# Altium project XS128转接板.PRJPCB
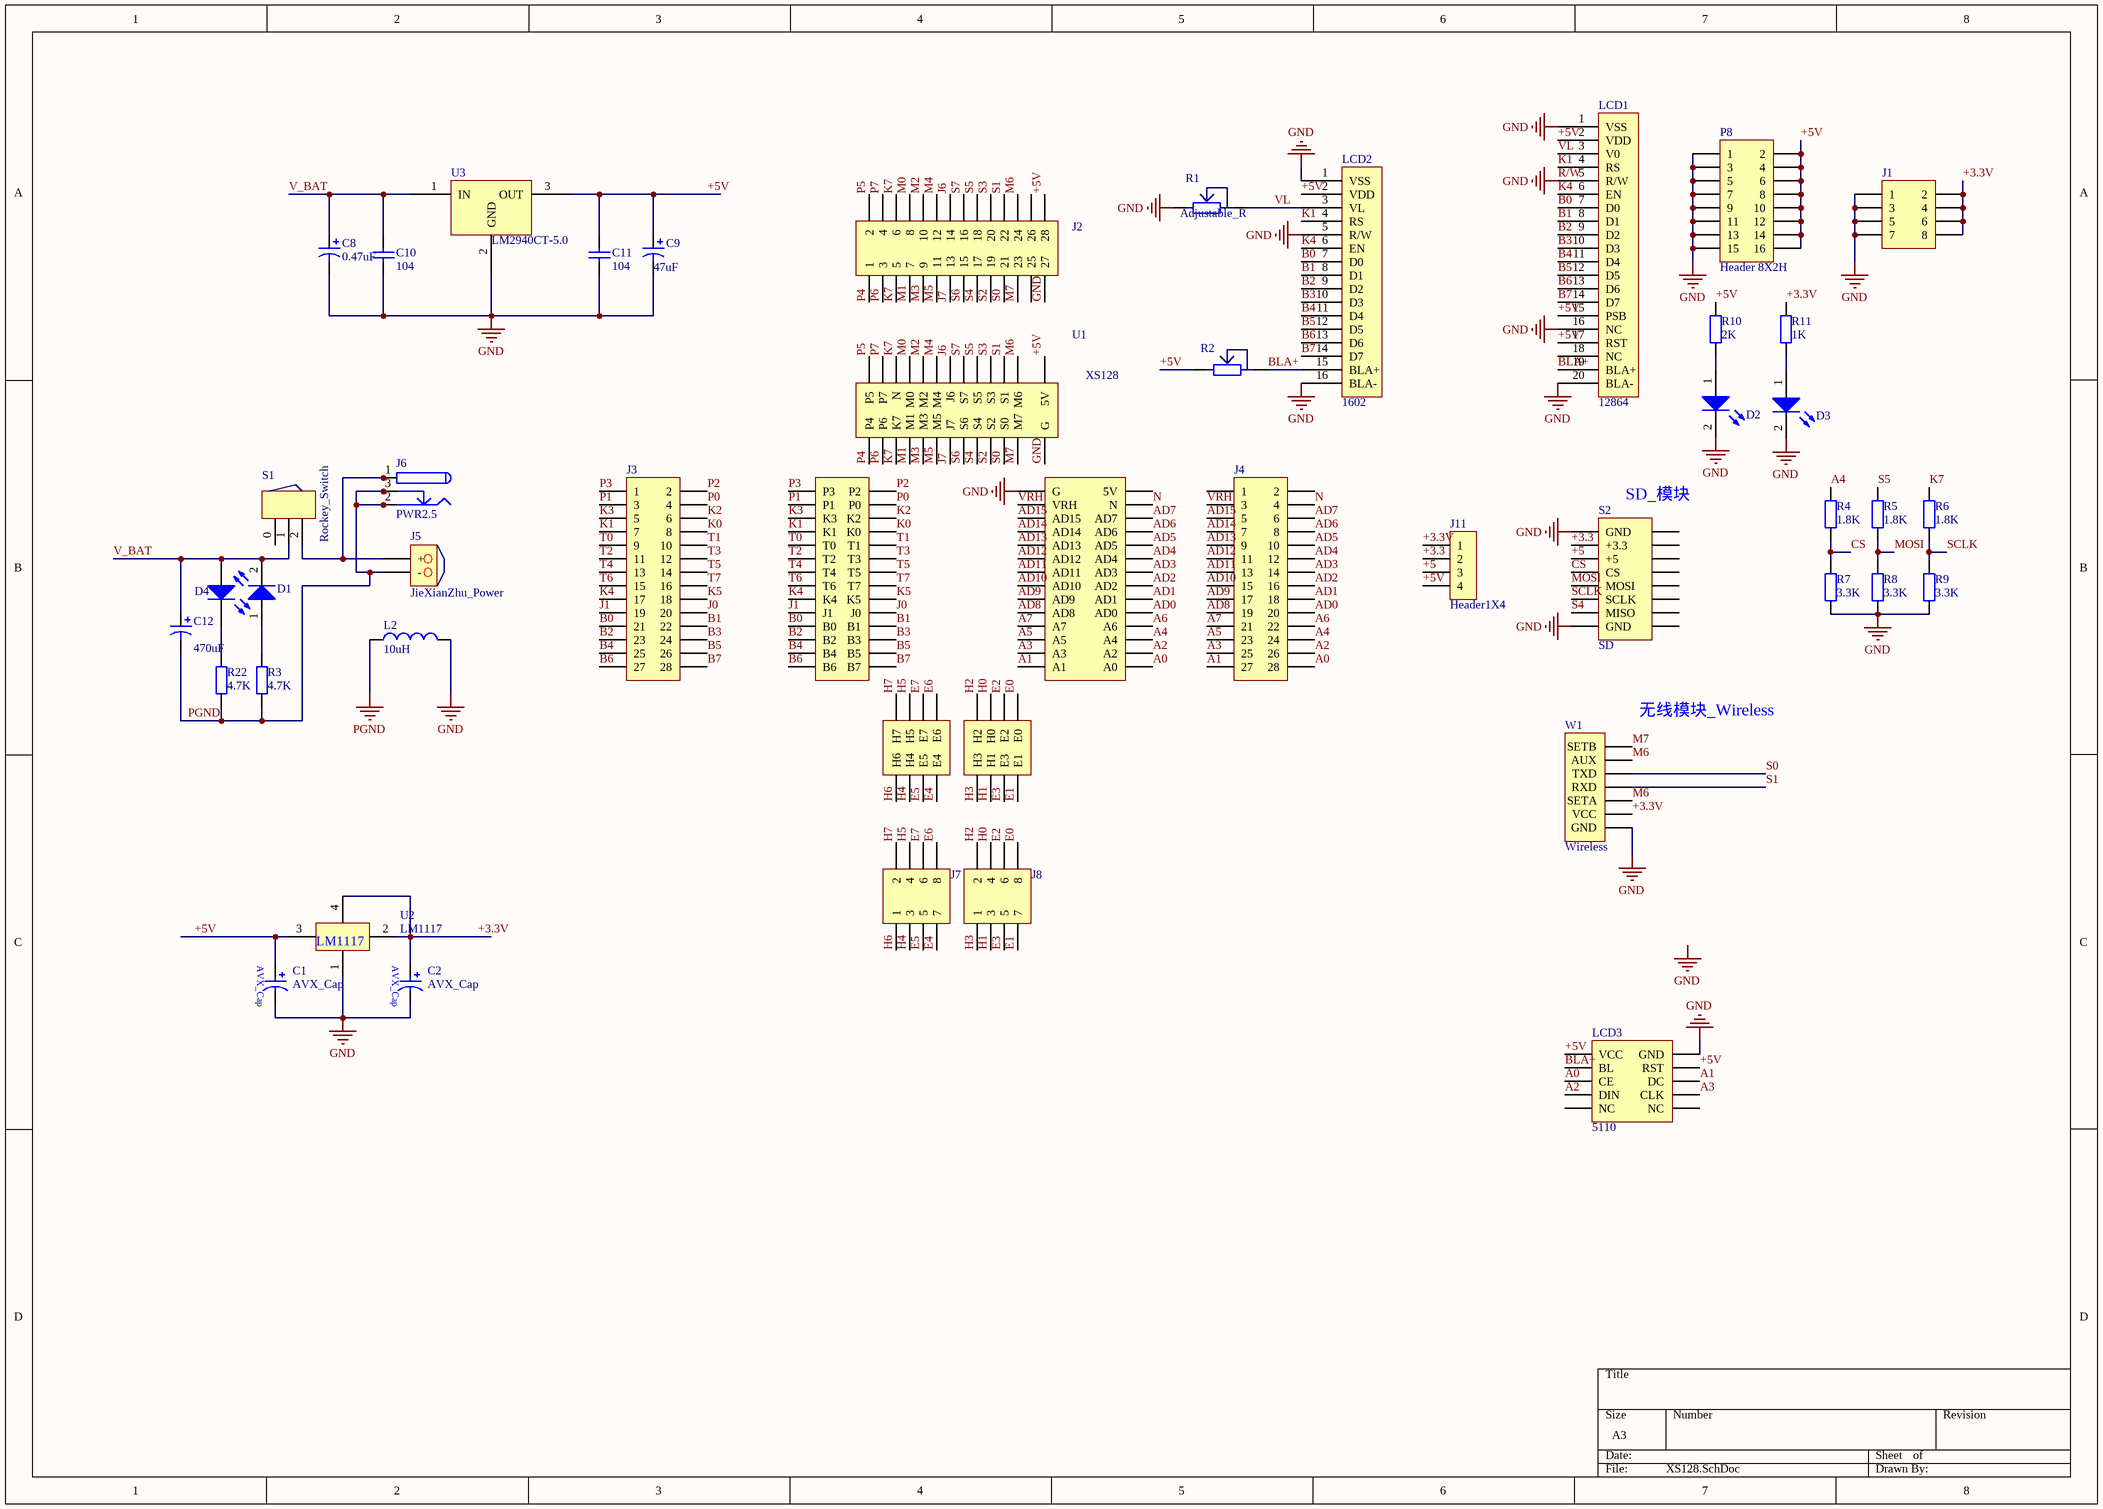
[diagram p0: XS128.SchDoc]
1 sheet, 43 parts. Net scope: global (net labels, ports and power ports of the same name join across sheets).
Board file: XS128.PcbDoc

## Sheet XS128.SchDoc
size A3

### Parts
C1  AVX_Cap  [AVX_Cap_10uF]
C2  AVX_Cap  [AVX_Cap_10uF]
C8  value 0.47uF  [0.47UF/50V]  (hidden comment: Cap Pol3)
C9  value 47uF  [47uf/25V]  (hidden comment: Cap Pol3)
C10  value 104  [6-0805]  (hidden comment: Cap)
C11  value 104  [6-0805]  (hidden comment: Cap)
C12  value 470uF  [470uF/25V]  (hidden comment: Cap Pol1)
D1  LED1  [0805电阻贴片]  (value not drawn)
D2  LED1  [0805电阻贴片]  (value not drawn)
D3  LED1  [0805电阻贴片]  (value not drawn)
D4  LED1  [3.2X1.6X1.1]  (value not drawn)
J1  Header 4X2  [HDR2X4]  (value not drawn)
J2  Header 14X2  [HDR2X14]  (value not drawn)
J3  Header 14X2  [HDR2X14]  (value not drawn)
J4  Header 14X2  [HDR2X14]  (value not drawn)
J5  JieXianZhu_Power  [jiexianzhu_power]
J6  PWR2.5  [KLD-0202]
J7  Header 4X2  [HDR2X4]  (value not drawn)
J8  Header 4X2  [HDR2X4]  (value not drawn)
J11  Header1X4  [HDR1X4]
L2  value 10uH  [INDUCTOR]  (hidden comment: Inductor)
LCD1  12864  [HDR!X20]
LCD2  1602  [HDR1X16]
LCD3  5110  [5110]
P8  Header 8X2H  [HDR2X8H]
R1  Adjustable_R  [Adjustable_R]
R2  Adjustable_R  [Adjustable_R]  (value not drawn)
R3  value 4.7K  [0805电阻贴片]  (hidden comment: Res2)
R4  value 1.8K  [0805电阻贴片]  (hidden comment: Res2)
R5  value 1.8K  [0805电阻贴片]  (hidden comment: Res2)
R6  value 1.8K  [0805电阻贴片]  (hidden comment: Res2)
R7  value 3.3K  [0805电阻贴片]  (hidden comment: Res2)
R8  value 3.3K  [0805电阻贴片]  (hidden comment: Res2)
R9  value 3.3K  [0805电阻贴片]  (hidden comment: Res2)
R10  value 2K  [0805电阻贴片]  (hidden comment: Res2)
R11  value 1K  [0805电阻贴片]  (hidden comment: Res2)
R22  value 4.7K  [2012[0805]]  (hidden comment: Res2)
S1  Rockey_Switch  [Rockey_Switch]
S2  SD  [SD]
U1  XS128  [XS128接口]
U2  LM1117  [SOT230LM1117]
U3  LM2940CT-5.0  [LM2940]
W1  Wireless  [WIRELESS]

### Nets
GND: C1.2(-) C2.2(-) C8.2 C9.2 C10.2 C11.2 D2.2(K) D3.2(K) J1.1 J1.3 J1.5 J1.7 J2.27 L2.2 LCD1.1(VSS) LCD1.5(R/W) LCD1.16(NC) LCD1.20(BLA-) LCD2.1(VSS) LCD2.5(R/W) LCD2.16(BLA-) LCD3.1(GND) P8.1 P8.3 P8.5 P8.7 P8.9 P8.11 P8.13 P8.15 R1.1 R7.2 R8.2 R9.2 S2.0(GND) S2.7(GND) U1.202(G) U1.328(G) U2.1(GND) U3.2(GND) W1.0(GND)  [also labelled R/W]
PGND: C12.2 J5.1(-) J6.2 J6.2A J6.2B J6.3 J6.3A J6.3B L2.1 R3.1 R22.1
+3.3: J11.2 S2.1(+3.3)
+3.3V: C2.1(+) J1.2 J1.4 J1.6 J1.8 J11.1 R11.2 U2.2(OUT) U2.4(TAB) W1.1(VCC)
+5: J11.3 S2.2(+5)
+5V: C1.1(+) C9.1 C11.1 J2.28 J11.4 LCD1.2(VDD) LCD1.15(PSB) LCD1.17(RST) LCD2.2(VDD) LCD3.0(VCC) LCD3.3(RST) P8.2 P8.4 P8.6 P8.8 P8.10 P8.12 P8.14 P8.16 R2.1 R10.2 U1.201(5V) U2.3(IN) U3.3(OUT)
A0: J4.28 LCD3.4(CE) U1.301(A0)
A1: J4.27 LCD3.5(DC) U1.302(A1)
A2: J4.26 LCD3.6(DIN) U1.303(A2)
A3: J4.25 LCD3.7(CLK) U1.304(A3)
A4: J4.24 R4.2 U1.305(A4)
A5: J4.23 U1.306(A5)
A6: J4.22 U1.307(A6)
A7: J4.21 U1.308(A7)
AD0: J4.20 U1.309(AD0)
AD1: J4.18 U1.311(AD1)
AD2: J4.16 U1.313(AD2)
AD3: J4.14 U1.315(AD3)
AD4: J4.12 U1.317(AD4)
AD5: J4.10 U1.319(AD5)
AD6: J4.8 U1.321(AD6)
AD7: J4.6 U1.323(AD7)
AD8: J4.19 U1.310(AD8)
AD9: J4.17 U1.312(AD9)
AD10: J4.15 U1.314(AD10)
AD11: J4.13 U1.316(AD11)
AD12: J4.11 U1.318(AD12)
AD13: J4.9 U1.320(AD13)
AD14: J4.7 U1.322(AD14)
AD15: J4.5 U1.324(AD15)
B0: J3.21 LCD1.7(D0) LCD2.7(D0) U1.121(B0)
B1: J3.22 LCD1.8(D1) LCD2.8(D1) U1.122(B1)
B2: J3.23 LCD1.9(D2) LCD2.9(D2) U1.123(B2)
B3: J3.24 LCD1.10(D3) LCD2.10(D3) U1.124(B3)
B4: J3.25 LCD1.11(D4) LCD2.11(D4) U1.125(B4)
B5: J3.26 LCD1.12(D5) LCD2.12(D5) U1.126(B5)
B6: J3.27 LCD1.13(D6) LCD2.13(D6) U1.127(B6)
B7: J3.28 LCD1.14(D7) LCD2.14(D7) U1.128(B7)
BLA+: LCD1.19(BLA+) LCD2.15(BLA+) LCD3.2(BL) R2.2
CS: R4.1 R7.1 S2.3(CS)
E0: J8.8 U1.508(E0)
E1: J8.7 U1.507(E1)
E2: J8.6 U1.506(E2)
E3: J8.5 U1.505(E3)
E4: J7.7 U1.407(E4)
E5: J7.5 U1.405(E5)
E6: J7.8 U1.408(E6)
E7: J7.6 U1.406(E7)
H0: J8.4 U1.504(H0)
H1: J8.3 U1.503(H1)
H2: J8.2 U1.502(H2)
H3: J8.1 U1.501(H3)
H4: J7.3 U1.403(H4)
H5: J7.4 U1.404(H5)
H6: J7.1 U1.401(H6)
H7: J7.2 U1.402(H7)
J0: J3.20 U1.120(J0)
J1: J3.19 U1.119(J1)
J6: J2.14 U1.215(J6)
J7: J2.13 U1.216(J7)
K0: J3.8 U1.108(K0)
K1: J3.7 LCD1.4(RS) LCD2.4(RS) U1.107(K1)
K2: J3.6 U1.106(K2)
K3: J3.5 U1.105(K3)
K4: J3.17 LCD1.6(EN) LCD2.6(EN) U1.117(K4)
K5: J3.18 U1.118(K5)
K7: J2.5 J2.6 R6.2 U1.223(N) U1.224(K7)
M0: J2.8 U1.221(M0)
M1: J2.7 U1.222(M1)
M2: J2.10 U1.219(M2)
M3: J2.9 U1.220(M3)
M4: J2.12 U1.217(M4)
M5: J2.11 U1.218(M5)
M6: J2.24 U1.205(M6) W1.2(SETA) W1.5(AUX)
M7: J2.23 U1.206(M7) W1.6(SETB)
MOSI: R5.1 R8.1 S2.4(MOSI)
N: J4.4 U1.325(N)
P0: J3.4 U1.104(P0)
P1: J3.3 U1.103(P1)
P2: J3.2 U1.102(P2)
P3: J3.1 U1.101(P3)
P4: J2.1 U1.228(P4)
P5: J2.2 U1.227(P5)
P6: J2.3 U1.226(P6)
P7: J2.4 U1.225(P7)
S0: J2.21 U1.208(S0) W1.4(TXD)
S1: J2.22 U1.207(S1) W1.3(RXD)
S2: J2.19 U1.210(S2)
S3: J2.20 U1.209(S3)
S4: J2.17 S2.6(MISO) U1.212(S4)
S5: J2.18 R5.2 U1.211(S5)
S6: J2.15 U1.214(S6)
S7: J2.16 U1.213(S7)
SCLK: R6.1 R9.1 S2.5(SCLK)
T0: J3.9 U1.109(T0)
T1: J3.10 U1.110(T1)
T2: J3.11 U1.111(T2)
T3: J3.12 U1.112(T3)
T4: J3.13 U1.113(T4)
T5: J3.14 U1.114(T5)
T6: J3.15 U1.115(T6)
T7: J3.16 U1.116(T7)
V_BAT: C8.1 C10.1 C12.1 D1.2(K) D4.1(A) S1.1(B) U3.1(IN)
VL: LCD1.3(V0) LCD2.3(VL) R1.2
VRH: J4.3 U1.326(VRH)
NetD1_1: D1.1(A) R3.2
NetD2_1: D2.1(A) R10.1
NetD3_1: D3.1(A) R11.1
NetD4_2: D4.2(K) R22.2
NetJ5_0: J5.0(+) J6.1 J6.1A J6.1B S1.2(C)

Not connected (* = marked no-connect by the designer): J2 25 26; J4 1 2; LCD1 18(NC); LCD3 8(NC) 9(NC); S1 0(A); S2 8 9 10 11 12 13 14 15; U1 327(5V)

### Notes on the sheet
- (near S2) SD_模块
- (near W1) 无线模块_Wireless
- Labels drawn without touching a wire or pin: GND

### Library data of the parts
C8 C9 = Cap: Polarized Capacitor (Surface Mount); Published: 8-Jun-2000; LatestRevisionDate: 17-Jul-2002; LatestRevisionNote: Re-released for DXP Platform.; PackageReference: C0805; Publisher: Altium Limited
C10 C11 = Cap: Capacitor; Published: 8-Jun-2000; LatestRevisionDate: 17-Jul-2002; LatestRevisionNote: Re-released for DXP Platform.; PackageReference: RAD-0.3; Publisher: Altium Limited
C12 = Cap Pol1: Polarized Capacitor (Radial); Published: 8-Jun-2000; LatestRevisionDate: 17-Jul-2002; LatestRevisionNote: Re-released for DXP Platform.; PackageReference: RB7.6-15; Publisher: Altium Limited
D1-D3 = LED1: RED_LED; Published: 8-Jun-2000; LatestRevisionDate: 08-Jul-2005; LatestRevisionNote: Mech Layer 1 removed.; PackageReference: LED-1; Publisher: Altium Limited
D4 = LED1: Typical RED GaAs LED; Published: 8-Jun-2000; LatestRevisionDate: 08-Jul-2005; LatestRevisionNote: Mech Layer 1 removed.; PackageReference: LED-1; Publisher: Altium Limited
J1 J7 J8 = Header 4X2: Header, 4-Pin, Dual row; LatestRevisionDate: 17-Jul-2002; LatestRevisionNote: Re-released for DXP Platform.; Publisher: Altium Limited
J2-J4 = Header 14X2: Header, 14-Pin, Dual row; LatestRevisionDate: 17-Jul-2002; LatestRevisionNote: Re-released for DXP Platform.; Publisher: Altium Limited
J6 = PWR2.5: Low Voltage Power Supply Connector; Published: 17-Dec-2003; DatasheetDocument: 09-May-2002; Publisher: Altium Limited; ComponentLink1Description: Manufacturer Link; ComponentLink1URL: http://domino.kycon.com/internet/Products.html
L2 = Indu: Code_IEC: 1005; Published: 8-Jun-2000; LatestRevisionDate: 17-Jul-2002; LatestRevisionNote: Re-released for DXP Platform.; PackageReference: 0402-A; Publisher: Altium Limited; Code_JEITA: 0402
P8 = Header 8X2H: Header, 8-Pin, Dual row, Right Angle; LatestRevisionDate: 17-Jul-2002; LatestRevisionNote: Re-released for DXP Platform.; Publisher: Altium Limited
R3-R11 R22 = Res2: Resistor; Published: 8-Jun-2000; LatestRevisionDate: 17-Jul-2002; LatestRevisionNote: Re-released for DXP Platform.; PackageReference: AXIAL-0.4; Publisher: Altium Limited
U3 = LM2940CT